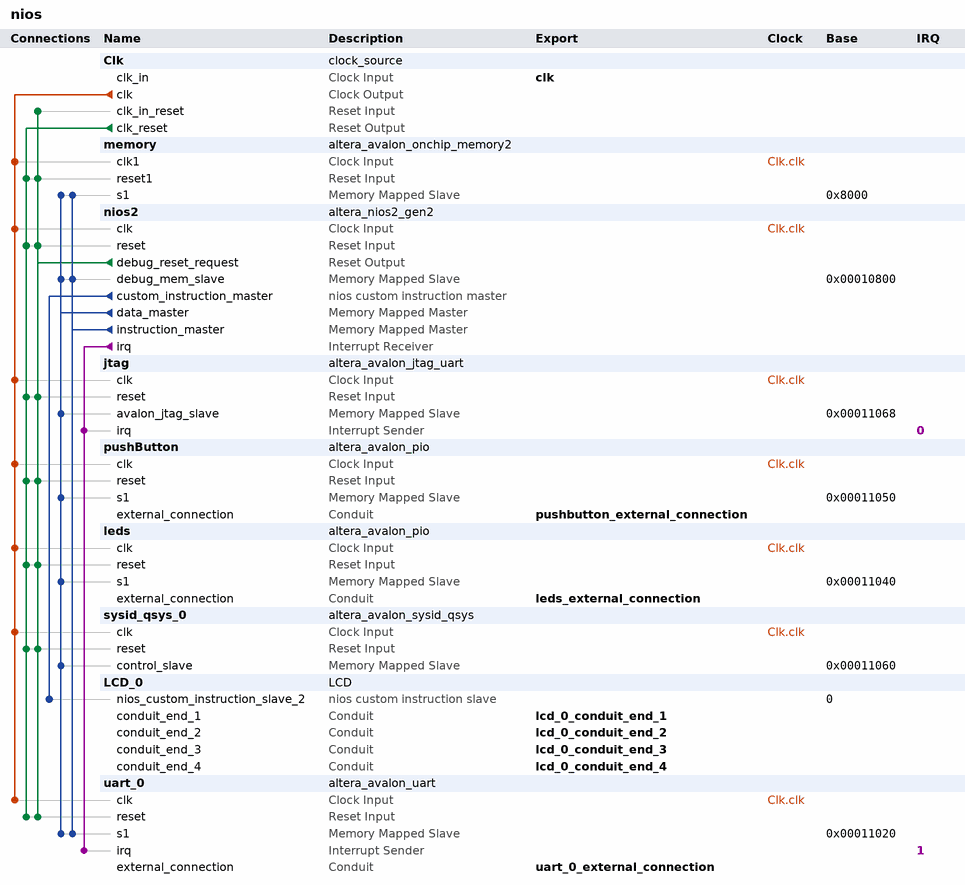
[diagram p0: system contents]
# Platform Designer (Qsys) system nios, Cyclone IV E EP4CE6E22C8
# Parameters at their usual value, and those the tool derives, are not listed.
package require -exact qsys 18.1
create_system nios
set_project_property DEVICE_FAMILY {Cyclone IV E}
set_project_property DEVICE EP4CE6E22C8

add_instance Clk clock_source 18.1
set_instance_parameter_value Clk clockFrequency 50000000

add_instance memory altera_avalon_onchip_memory2 18.1
set_instance_parameter_value memory dataWidth 32
set_instance_parameter_value memory dualPort false
set_instance_parameter_value memory initMemContent true
set_instance_parameter_value memory initializationFileName C:/Users/Gabriel/Desktop/CodeVerilog/Sistemas-Digitais/software/nios_1/mem_init/nios_memory.hex
set_instance_parameter_value memory memorySize 21280
set_instance_parameter_value memory useNonDefaultInitFile true

add_instance nios2 altera_nios2_gen2 18.1
set_instance_parameter_value nios2 dcache_size 2048
set_instance_parameter_value nios2 exceptionSlave memory.s1
set_instance_parameter_value nios2 icache_size 4096
set_instance_parameter_value nios2 impl Tiny
set_instance_parameter_value nios2 resetSlave memory.s1

add_instance jtag altera_avalon_jtag_uart 18.1
set_instance_parameter_value jtag simInteractiveOptions NO_INTERACTIVE_WINDOWS

add_instance pushButton altera_avalon_pio 18.1
set_instance_parameter_value pushButton direction Input
set_instance_parameter_value pushButton width 4

add_instance leds altera_avalon_pio 18.1
set_instance_parameter_value leds direction Output
set_instance_parameter_value leds width 4

add_instance sysid_qsys_0 altera_avalon_sysid_qsys 18.1
set_instance_parameter_value sysid_qsys_0 id 4919

add_instance LCD_0 LCD 1.0

add_instance uart_0 altera_avalon_uart 18.1
set_instance_parameter_value uart_0 baud 115200
set_instance_parameter_value uart_0 dataBits 8
set_instance_parameter_value uart_0 fixedBaud true
set_instance_parameter_value uart_0 parity NONE
set_instance_parameter_value uart_0 stopBits 1

# connections
add_connection Clk.clk jtag.clk clock
add_connection Clk.clk leds.clk clock
add_connection Clk.clk memory.clk1 clock
add_connection Clk.clk nios2.clk clock
add_connection Clk.clk pushButton.clk clock
add_connection Clk.clk sysid_qsys_0.clk clock
add_connection Clk.clk uart_0.clk clock
add_connection Clk.clk_reset jtag.reset reset
add_connection Clk.clk_reset leds.reset reset
add_connection Clk.clk_reset memory.reset1 reset
add_connection Clk.clk_reset nios2.reset reset
add_connection Clk.clk_reset pushButton.reset reset
add_connection Clk.clk_reset sysid_qsys_0.reset reset
add_connection Clk.clk_reset uart_0.reset reset
add_connection nios2.debug_reset_request Clk.clk_in_reset reset
add_connection nios2.debug_reset_request jtag.reset reset
add_connection nios2.debug_reset_request leds.reset reset
add_connection nios2.debug_reset_request memory.reset1 reset
add_connection nios2.debug_reset_request nios2.reset reset
add_connection nios2.debug_reset_request pushButton.reset reset
add_connection nios2.debug_reset_request sysid_qsys_0.reset reset
add_connection nios2.debug_reset_request uart_0.reset reset
add_connection nios2.data_master jtag.avalon_jtag_slave avalon
set_connection_parameter_value nios2.data_master/jtag.avalon_jtag_slave baseAddress 0x00011068
add_connection nios2.data_master leds.s1 avalon
set_connection_parameter_value nios2.data_master/leds.s1 baseAddress 0x00011040
add_connection nios2.data_master memory.s1 avalon
set_connection_parameter_value nios2.data_master/memory.s1 baseAddress 0x8000
add_connection nios2.data_master nios2.debug_mem_slave avalon
set_connection_parameter_value nios2.data_master/nios2.debug_mem_slave baseAddress 0x00010800
add_connection nios2.data_master pushButton.s1 avalon
set_connection_parameter_value nios2.data_master/pushButton.s1 baseAddress 0x00011050
add_connection nios2.data_master sysid_qsys_0.control_slave avalon
set_connection_parameter_value nios2.data_master/sysid_qsys_0.control_slave baseAddress 0x00011060
add_connection nios2.data_master uart_0.s1 avalon
set_connection_parameter_value nios2.data_master/uart_0.s1 baseAddress 0x00011020
add_connection nios2.instruction_master memory.s1 avalon
set_connection_parameter_value nios2.instruction_master/memory.s1 baseAddress 0x8000
add_connection nios2.instruction_master nios2.debug_mem_slave avalon
set_connection_parameter_value nios2.instruction_master/nios2.debug_mem_slave baseAddress 0x00010800
add_connection nios2.instruction_master uart_0.s1 avalon
set_connection_parameter_value nios2.instruction_master/uart_0.s1 baseAddress 0x00011020
add_connection nios2.irq jtag.irq interrupt
set_connection_parameter_value nios2.irq/jtag.irq irqNumber 0
add_connection nios2.irq uart_0.irq interrupt
set_connection_parameter_value nios2.irq/uart_0.irq irqNumber 1
add_connection nios2.custom_instruction_master LCD_0.nios_custom_instruction_slave_2 nios_custom_instruction
set_connection_parameter_value nios2.custom_instruction_master/LCD_0.nios_custom_instruction_slave_2 CIName lcd_0
set_connection_parameter_value nios2.custom_instruction_master/LCD_0.nios_custom_instruction_slave_2 baseAddress 0

# exported interfaces
add_interface clk clock sink
set_interface_property clk EXPORT_OF Clk.clk_in
add_interface lcd_0_conduit_end_1 conduit end
set_interface_property lcd_0_conduit_end_1 EXPORT_OF LCD_0.conduit_end_1
add_interface lcd_0_conduit_end_2 conduit end
set_interface_property lcd_0_conduit_end_2 EXPORT_OF LCD_0.conduit_end_2
add_interface lcd_0_conduit_end_3 conduit end
set_interface_property lcd_0_conduit_end_3 EXPORT_OF LCD_0.conduit_end_3
add_interface lcd_0_conduit_end_4 conduit end
set_interface_property lcd_0_conduit_end_4 EXPORT_OF LCD_0.conduit_end_4
add_interface leds_external_connection conduit end
set_interface_property leds_external_connection EXPORT_OF leds.external_connection
add_interface pushbutton_external_connection conduit end
set_interface_property pushbutton_external_connection EXPORT_OF pushButton.external_connection
add_interface uart_0_external_connection conduit end
set_interface_property uart_0_external_connection EXPORT_OF uart_0.external_connection

set_interconnect_requirement {$system} qsys_mm.clockCrossingAdapter HANDSHAKE
set_interconnect_requirement {$system} qsys_mm.enableEccProtection FALSE
set_interconnect_requirement {$system} qsys_mm.insertDefaultSlave FALSE
set_interconnect_requirement {$system} qsys_mm.maxAdditionalLatency 1

save_system nios.qsys
